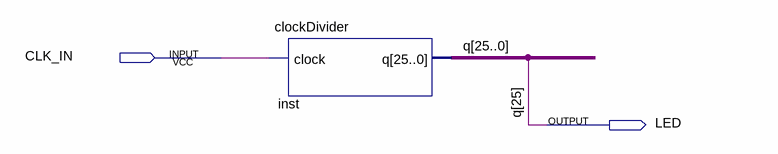
[diagram p0: schematic sheet]
// Quartus schematic blink.bdf as structural Verilog: 1 symbols, 2 pins
module blink (
  input  CLK_IN,
  output LED
);

  wire [24:0] q;

  clockDivider inst (.clock(CLK_IN), .q({LED, q}));

  // Other names for the same wires on the sheet: q[25] = LED
endmodule
